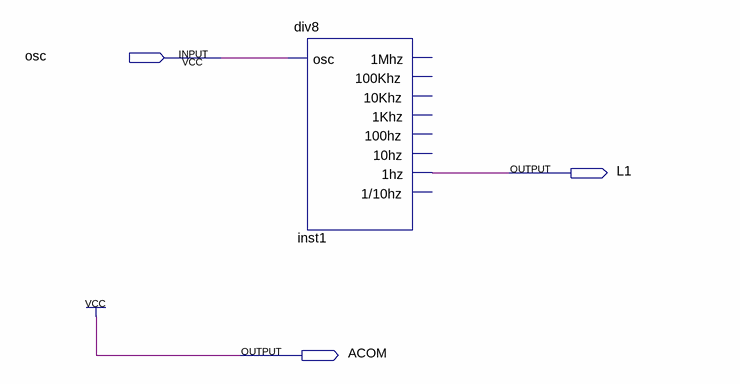
[diagram p0: schematic sheet]
// Quartus schematic div88.bdf as structural Verilog: 1 symbols, 3 pins
module div88 (
  input  osc,
  output L1,
  output ACOM
);

  div8 inst1 (.osc(osc), .\1hz (L1));  // open: 1Mhz, 100Khz, 10Khz, 1Khz, 100hz, 10hz, 1/10hz

  assign ACOM = 1'b1;
endmodule
